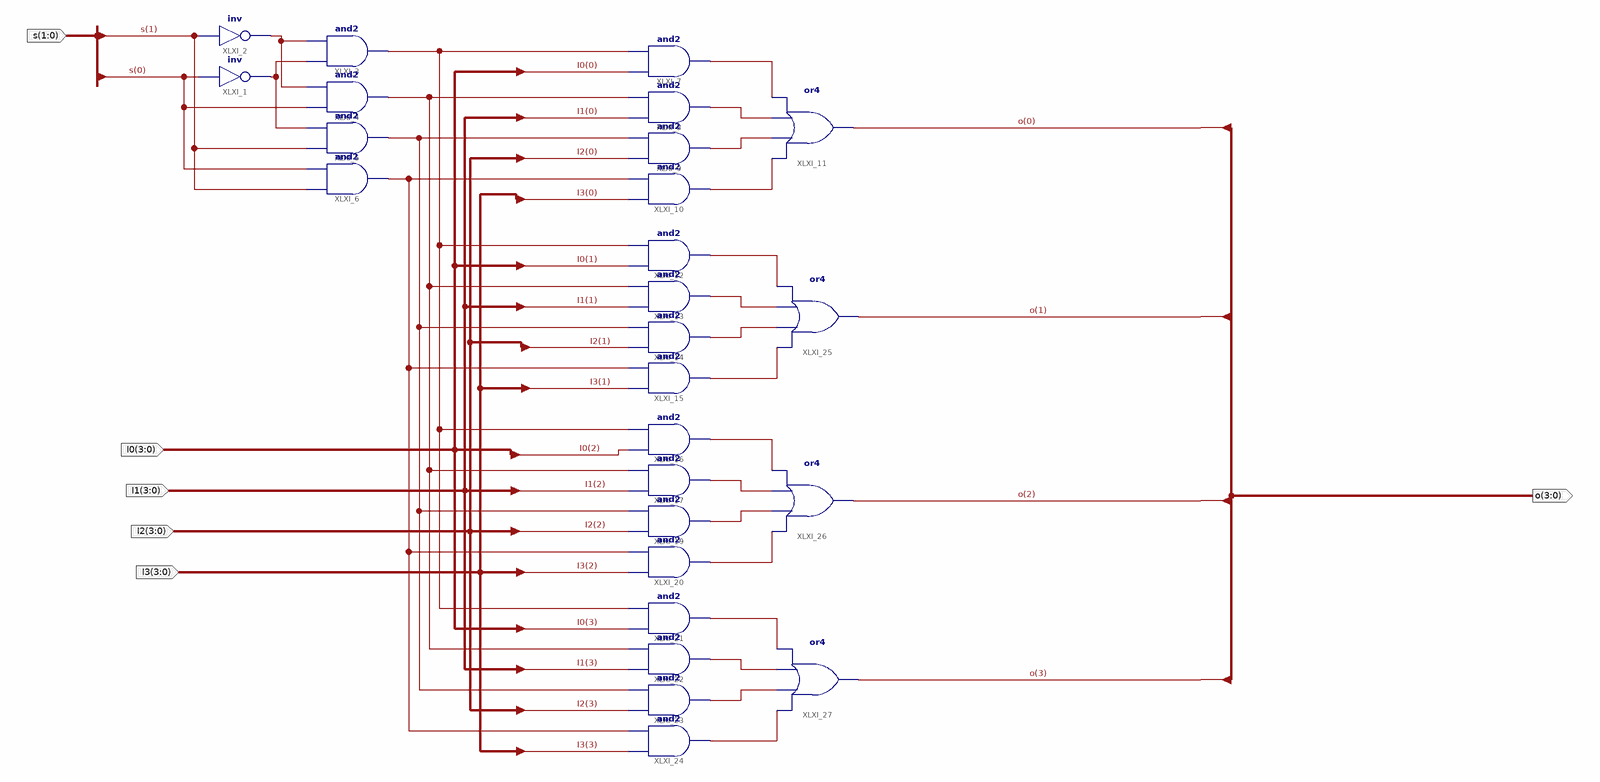
[diagram p0: schematic sheet 1]
// Xilinx ISE schematic Mux4to1b4.sch (kintex7) as structural Verilog: 26 symbols, 6 ports
module Mux4to1b4 (
  input  [1:0] s,
  input  [3:0] I0,
  input  [3:0] I1,
  input  [3:0] I2,
  input  [3:0] I3,
  output [3:0] o
);

  wire XLXN_5, XLXN_7, XLXN_19, XLXN_20, XLXN_21, XLXN_22, XLXN_23, XLXN_24, XLXN_25, XLXN_28, XLXN_29,
       XLXN_30, XLXN_31, XLXN_32, XLXN_33, XLXN_34, XLXN_35, XLXN_36, XLXN_37, XLXN_40, XLXN_45, XLXN_48;

  not XLXI_1 (XLXN_7, s[0]);
  not XLXI_2 (XLXN_5, s[1]);
  and XLXI_3 (XLXN_37, XLXN_7, XLXN_5);
  and XLXI_4 (XLXN_40, s[0], XLXN_5);
  and XLXI_5 (XLXN_45, s[1], XLXN_7);
  and XLXI_6 (XLXN_48, s[1], s[0]);
  and XLXI_7 (XLXN_19, I0[0], XLXN_37);
  and XLXI_8 (XLXN_22, I1[0], XLXN_40);
  and XLXI_9 (XLXN_21, I2[0], XLXN_45);
  and XLXI_10 (XLXN_20, I3[0], XLXN_48);
  or XLXI_11 (o[0], XLXN_20, XLXN_21, XLXN_22, XLXN_19);
  and XLXI_12 (XLXN_23, I0[1], XLXN_37);
  and XLXI_13 (XLXN_24, I1[1], XLXN_40);
  and XLXI_14 (XLXN_25, I2[1], XLXN_45);
  and XLXI_15 (XLXN_28, I3[1], XLXN_48);
  and XLXI_16 (XLXN_29, I0[2], XLXN_37);
  and XLXI_17 (XLXN_30, I1[2], XLXN_40);
  and XLXI_19 (XLXN_31, I2[2], XLXN_45);
  and XLXI_20 (XLXN_32, I3[2], XLXN_48);
  and XLXI_21 (XLXN_33, I0[3], XLXN_37);
  and XLXI_22 (XLXN_34, I1[3], XLXN_40);
  and XLXI_23 (XLXN_35, I2[3], XLXN_45);
  and XLXI_24 (XLXN_36, I3[3], XLXN_48);
  or XLXI_25 (o[1], XLXN_28, XLXN_25, XLXN_24, XLXN_23);
  or XLXI_26 (o[2], XLXN_32, XLXN_31, XLXN_30, XLXN_29);
  or XLXI_27 (o[3], XLXN_36, XLXN_35, XLXN_34, XLXN_33);
endmodule
